# EAGLE design MHI-SPI_v1.0 (EAGLE 9.4.2)
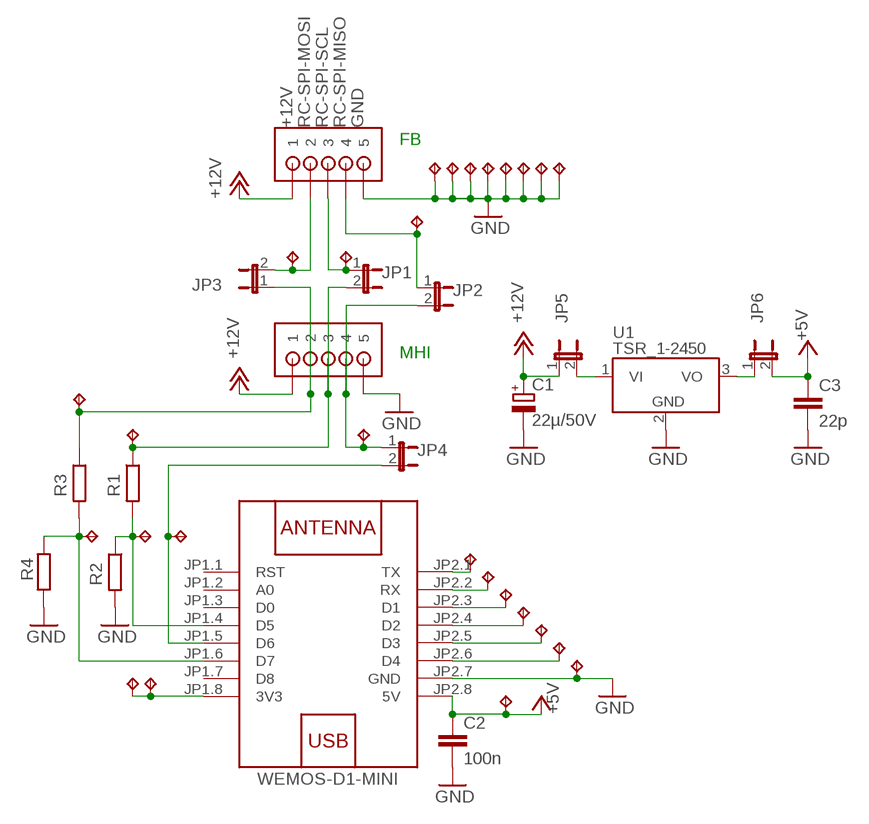
[diagram p0: schematic, sheet 1]

## Parts
C1  22µ/50V  CPOL-EUE5-10.5  [E5-10,5]
C2  100n  C-EU025-024X044  [C025-024X044]
C3  22p  C-EU025-024X044  [C025-024X044]
JP1  JP1E  [JP1]
JP2  JP1E  [JP1]
JP3  JP1E  [JP1]
JP4  JP1E  [JP1]
JP5  JP1E  [JP1]
JP6  JP1E  [JP1]
R1  R-EU_VMTA55  [VMTA55]
R2  R-EU_VMTA55  [VMTA55]
R3  R-EU_VMTA55  [VMTA55]
R4  R-EU_VMTA55  [VMTA55]
TP1  TPPAD1-13  [P1-13]
TP2  TPPAD1-13  [P1-13]
TP3  TPPAD1-13  [P1-13]
TP4  TPPAD1-13  [P1-13]
TP5  TPPAD1-13  [P1-13]
TP6  TPPAD1-13  [P1-13]
TP7  TPPAD1-13  [P1-13]
TP8  TPPAD1-13  [P1-13]
TP9  TPPAD1-13  [P1-13]
TP10  TPPAD1-13  [P1-13]
TP11  TPPAD1-13  [P1-13]
TP12  TPPAD1-13  [P1-13]
TP13  TPPAD1-13  [P1-13]
TP14  TPPAD1-13  [P1-13]
TP15  TPPAD1-13  [P1-13]
TP16  TPPAD1-13  [P1-13]
TP17  TPPAD1-13  [P1-13]
TP18  TPPAD1-13  [P1-13]
TP19  TPPAD1-13  [P1-13]
TP20  TPPAD1-13  [P1-13]
TP21  TPPAD1-13  [P1-13]
TP22  TPPAD1-13  [P1-13]
TP23  TPPAD1-13  [P1-13]
TP24  TPPAD1-13  [P1-13]
TP25  TPPAD1-13  [P1-13]
TP26  TPPAD1-13  [P1-13]
TP27  TPPAD1-13  [P1-13]
U1  TSR_1-2450  TSR_1-24_  [TSR-1]
U$1  WEMOS-D1-MINI  [WEMOS-D1-MINI]
U$4  JST-PH_5-PIN_HEADER  [JST_B5B-PH_HEADER]
U$5  JST-PH_5-PIN_HEADER  [JST_B5B-PH_HEADER]

## Nets
+3V3: TP22.TP TP23.TP U$1.JP1.8(3V3)
+5V: C2.1 C3.1 JP6.2 TP21.TP U$1.JP2.8(5V)
+12V: C1.+ JP5.1 U$4.P1 U$5.P1
D1: TP16.TP U$1.JP2.3(D1)
D2: TP17.TP U$1.JP2.4(D2)
D3: TP18.TP U$1.JP2.5(D3)
D4: TP19.TP U$1.JP2.6(D4)
GND: C1.- C2.2 C3.2 R2.2 R4.1 TP1.TP TP2.TP TP3.TP TP4.TP TP20.TP TP24.TP TP25.TP TP26.TP TP27.TP U1.2(GND) U$1.JP2.7(GND) U$4.P5 U$5.P5
MHI-SPI-MISO: JP2.2 JP4.1 TP8.TP U$5.P4
MHI-SPI-MOSI: JP3.1 R3.1 TP10.TP U$5.P2
MHI-SPI-SCL: JP1.2 R1.1 TP9.TP U$5.P3
MISO: JP4.2 TP11.TP U$1.JP1.5(D6)
MOSI: R3.2 R4.2 TP13.TP U$1.JP1.6(D7)
N$86: JP6.1 U1.3(VO)
RC-SPI-MISO: JP2.1 TP5.TP U$4.P4
RC-SPI-MOSI: JP3.2 TP7.TP U$4.P2
RC-SPI-SCL: JP1.1 TP6.TP U$4.P3
RX: TP15.TP U$1.JP2.2(RX)
SCK: R1.2 R2.1 TP12.TP U$1.JP1.4(D5)
TX: TP14.TP U$1.JP2.1(TX)
VI: JP5.2 U1.1(VI)
Unconnected: U$1.JP1.1(RST) U$1.JP1.2(A0) U$1.JP1.3(D0) U$1.JP1.7(D8)

## Notes on the sheet
- FB
- MHI

## Library data of the parts
C1 = rcl:CPOL-EU: POLARIZED CAPACITOR, European symbol; SPICEPREFIX: C
C2 C3 = rcl:C-EU: CAPACITOR, European symbol; SPICEPREFIX: C
JP1-JP6 = jumper:JP1E: JUMPER
R1-R4 = rcl:R-EU_: RESISTOR, European symbol; SPICEPREFIX: R
TP1-TP27 = testpad:TP: Test pad
U1 = _traco_tsr-1:TSR_1-*: TRACO TSR-1 Series Point-of-Load DC/DC-Converters Vi max. 36 V; Vo = (1.2 .. 15)V ±2%; Io = 0 .. 1 A SIP-Package (drop-in replacement for 78xx linear voltage regulators in TO220-package, vertically assembled) Source: www.tracopower.com Technologies: TSR 1- Vi (V) Vo (V) ±2% Io = 0 .. 1 A 24_ ( generic ) 2412 4.6 .. 36 1.2 2415 4.6 .. 36 1.5 2418 4.6 .. 36 1.8 2425 4.6 .. 36 2.5 2433 4.75.. 36 3.3 2450 6.5 .. 36 5.0 2465 9.0 .. 36 6.5 2490 12 .. 36 9.0 24120 15 .. 36 12 24150 18 .. 36 15 Author: Dipl.-Ing. FH Rainer Bayer HHN Hochschule Heilbronn, rainer.bayer@hs-heilbronn.de Ingenieurbüro ing-rb, mail@ing-rb.de
U$1 = diy-modules:WEMOS-D1-MINI: WEMOS D1 mini: Mini Wi-Fi Board based on ESP-8266 device More details can be found here: https://www.wemos.cc/product/d1-mini.html Click here to find device on ebay.com <http://www.ebay.com/sch/wemos+d1+mini+nodemcu>
U$4 U$5 = srg:JST-PH_5-PIN_HEADER: 5-pin JST PH Shrouded Header, top entry P/N B5B-PH-K-S Mating connector PHR-5 Mating cable assembly: Sparkfun PRT-09917 <http://www.sparkfun.com/products/9917>

## Board
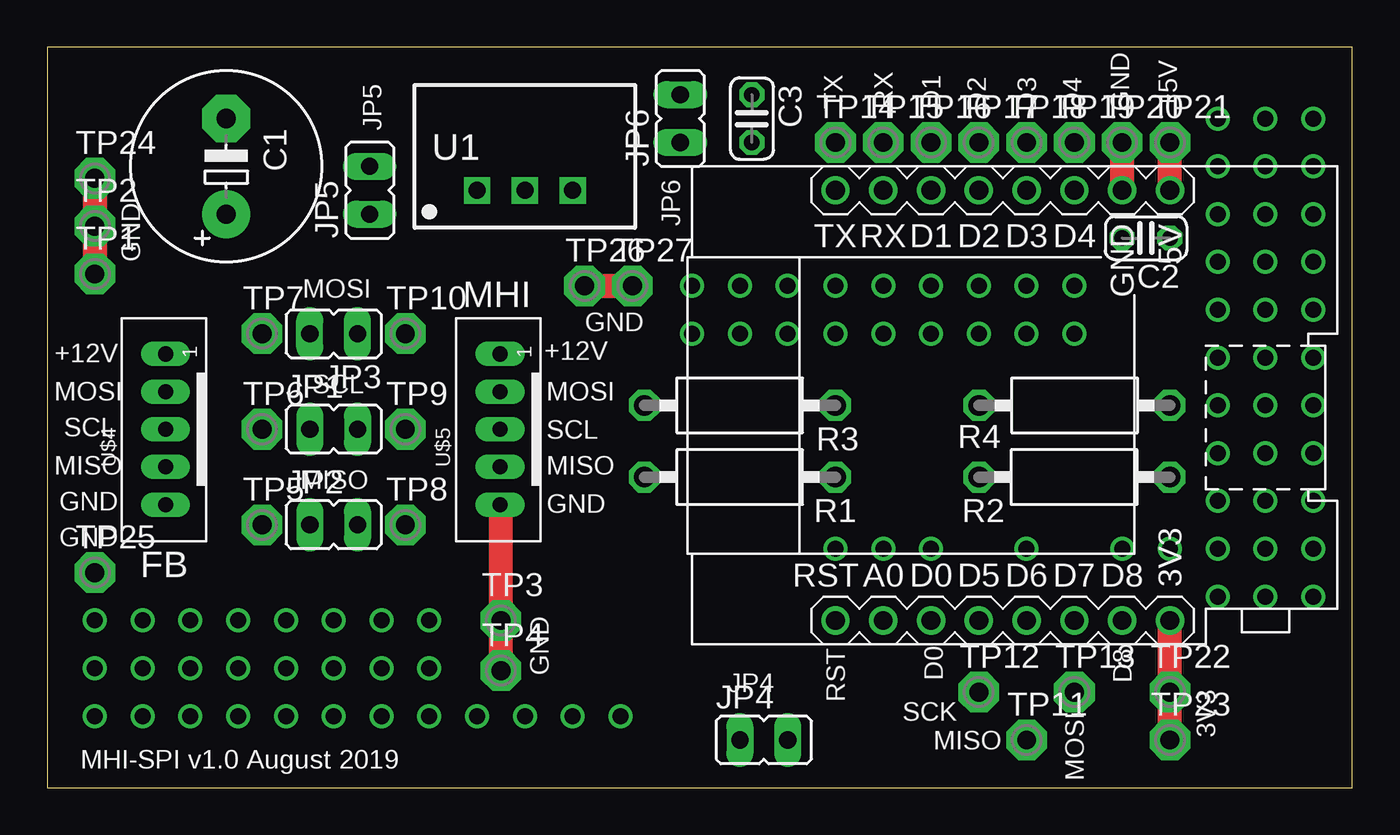
[diagram p1: board, top side]
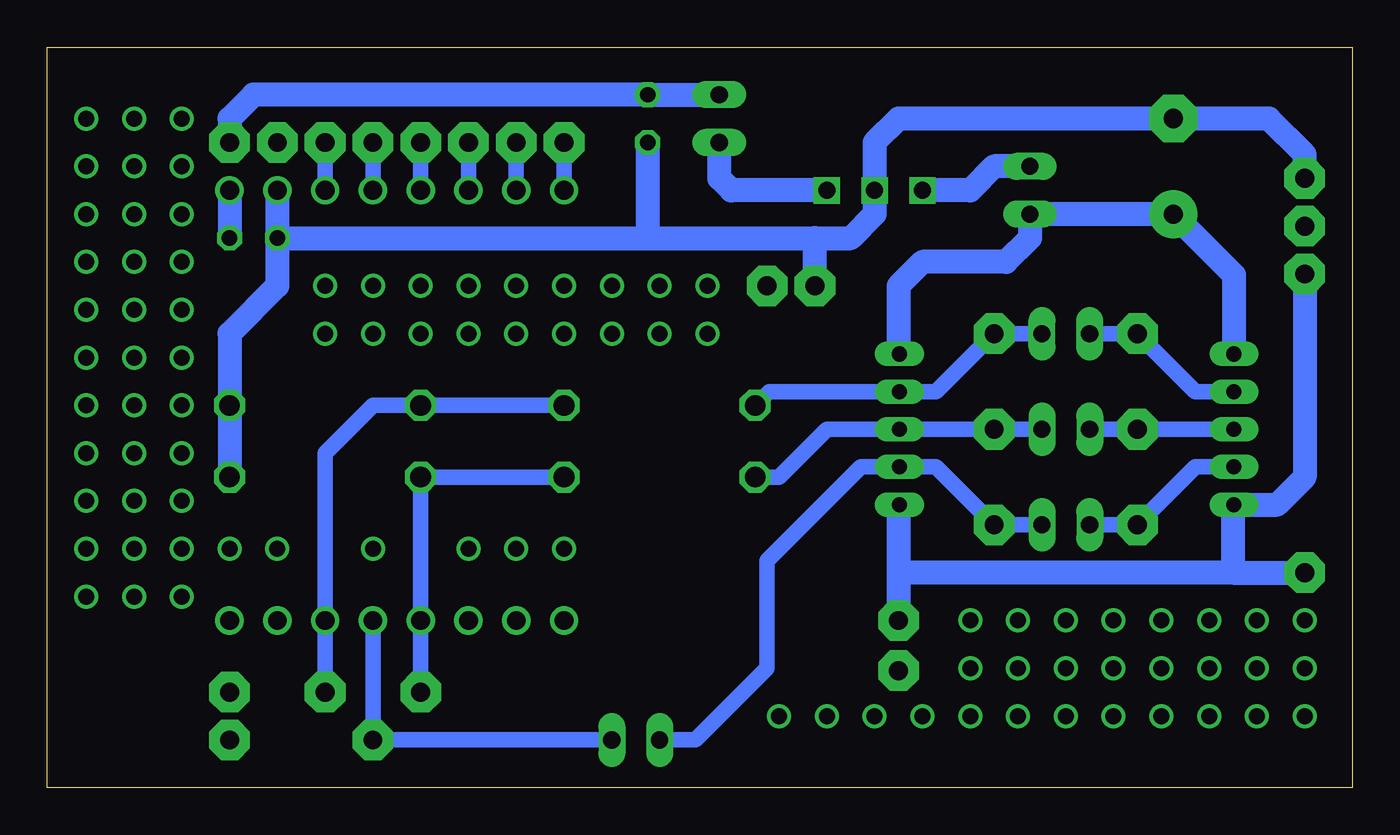
[diagram p2: board, bottom side, seen from below]

Size 69.39 x 39.36 mm. Coordinates in mm from the lower left corner, seen from the top.
Outline: 0,0 69.39,0 69.39,39.36 0,39.36 0,0
Copper layers (1*16): Top 0.035mm / dielectric 1.5mm / Bottom 0.035mm
Design rules "default": minimum track width 6mil, minimum drill 0.35mm, track to track 6mil, track to pad 6mil, pad to pad 6mil, via to via 6mil, smd to smd 6mil, copper to edge 40mil, drill to drill 6mil, minimum pad ring 10mil, minimum via ring 8mil, stop-mask expansion 4mil, vias tented up to drill 0mil, thermal gap 10mil

### Footprints (pad centres in the part's own frame; a part is rotated, then mirrored left to right if it is on the bottom)
E5-10,5 = drill 1.016 pad 2.54: + -2.54,0 | drill 1.016 pad 2.54 octagon: - 2.54,0
C025-024X044 = drill 0.813 octagon: 1 -1.27,0; 2 1.27,0
JP1 = drill 0.914 long: 1 0,-1.27; 2 0,1.27
VMTA55 = drill 1.1 octagon: 1 -5.08,0; 2 5.08,0
P1-13 = drill 1 pad 2.159 octagon: TP 0,0
TSR-1 = drill 0.9 square: 1 -2.54,0; 2 0,0; 3 2.54,0
WEMOS-D1-MINI = drill 1: JP1.1 -11.43,9.525; JP1.2 -11.43,6.985; JP1.3 -11.43,4.445; JP1.4 -11.43,1.905; JP1.5 -11.43,-0.635; JP1.6 -11.43,-3.175; JP1.7 -11.43,-5.715; JP1.8 -11.43,-8.255; JP2.1 11.43,9.525; JP2.2 11.43,6.985; JP2.3 11.43,4.445; JP2.4 11.43,1.905; JP2.5 11.43,-0.635; JP2.6 11.43,-3.175; JP2.7 11.43,-5.715; JP2.8 11.43,-8.255
JST_B5B-PH_HEADER = drill 0.8 long: P1 4,0.048; P2 2,0.048; P3 0,0.048; P4 -2,0.048; P5 -4,0.048

### Placement (x,y rotation side)
C1  9.53,33.02 90 top
C2  58.42,29.21 180 top
C3  37.47,35.56 270 top
JP1  15.24,19.05 270 top
JP2  15.24,13.97 270 top
JP3  15.24,24.13 90 top
JP4  38.1,2.54 270 top
JP5  17.14,31.75 0 top
JP6  33.66,35.56 0 top
R1  36.83,16.51 0 top
R2  54.61,16.51 0 top
R3  36.83,20.32 0 top
R4  54.61,20.32 180 top
TP1  2.54,27.3 0 top
TP2  2.54,29.84 0 top
TP3  24.13,8.89 0 top
TP4  24.13,6.22 0 top
TP5  11.43,13.97 0 top
TP6  11.43,19.05 0 top
TP7  11.43,24.13 0 top
TP8  19.05,13.97 0 top
TP9  19.05,19.05 0 top
TP10  19.05,24.13 0 top
TP11  52.07,2.54 0 top
TP12  49.53,5.08 0 top
TP13  54.61,5.08 0 top
TP14  41.91,34.29 0 top
TP15  44.45,34.29 0 top
TP16  46.99,34.29 0 top
TP17  49.53,34.29 0 top
TP18  52.07,34.29 0 top
TP19  54.61,34.29 0 top
TP20  57.15,34.29 0 top
TP21  59.69,34.29 0 top
TP22  59.69,5.08 0 top
TP23  59.69,2.54 0 top
TP24  2.54,32.38 0 top
TP25  2.54,11.43 0 top
TP26  28.57,26.67 0 top
TP27  31.11,26.67 0 top
U1  25.4,31.75 0 top
U$1  51.44,20.32 90 top
U$4  6.35,19.05 90 top
U$5  24.13,19.05 90 top

### Tracks (layer width: path | path; a pad name or v marks a point on that pad's centre or on a via)
+3V3
  Top 1.27: TP23.TP TP22.TP U$1.JP1.8
+5V
  Top 1.27: U$1.JP2.8 TP21.TP
  Bottom 1.27: U$1.JP2.8 C2.1 | JP6.2 C3.1 58.42,36.83 59.69,35.56 TP21.TP
+12V
  Bottom 1.27: U$4.P1 6.3,27.26 C1.+ JP5.1 17.14,29.21 18.41,27.94 22.86,27.94 24.13,26.67 24.13,23.1 U$5.P1
D1
  Bottom 0.813: TP16.TP U$1.JP2.3
D2
  Bottom 0.813: TP17.TP U$1.JP2.4
D3
  Bottom 0.813: TP18.TP U$1.JP2.5
D4
  Bottom 0.813: TP19.TP U$1.JP2.6
GND
  Top 1.27: TP4.TP TP3.TP 24.13,15 U$5.P5 | U$1.JP2.7 TP20.TP | TP26.TP TP27.TP | TP24.TP TP2.TP TP1.TP
  Bottom 1.27: R2.2 R4.1 59.69,24.13 57.15,26.67 C2.2 | C2.2 37.47,29.21 | 37.47,29.21 28.57,29.21 | 28.57,29.21 26.67,29.21 25.4,30.48 U1.2 25.4,34.29 24.13,35.56 C1.- 4.45,35.56 2.54,33.66 TP24.TP | U$1.JP2.7 C2.2 | C3.2 37.47,29.21 | 6.35,11.43 6.35,15 U$4.P5 4,15.05 2.54,16.51 TP1.TP | 6.35,11.43 24.13,11.43 | 24.13,11.43 TP3.TP | U$5.P5 24.13,15 24.13,11.43 | 6.35,11.43 TP25.TP | TP26.TP 28.57,29.21
MHI-SPI-MISO
  Bottom 0.813: JP4.1 34.92,2.54 31.11,6.35 31.11,12.06 26.13,17.05 U$5.P4 22.13,17.05 TP8.TP JP2.2
MHI-SPI-MOSI
  Bottom 0.813: R3.1 31.02,21.05 U$5.P2 22.13,21.05 TP10.TP JP3.1
MHI-SPI-SCL
  Bottom 0.813: R1.1 30.48,16.51 27.94,19.05 U$5.P3 TP9.TP JP1.2
MISO
  Bottom 0.813: U$1.JP1.5 TP11.TP JP4.2
MOSI
  Bottom 0.813: R3.2 R4.2 52.07,20.32 54.61,17.78 U$1.JP1.6 TP13.TP
N$1  (via drill 0.85)
  other vias: 2.54,6.35
N$2  (via drill 0.85)
  other vias: 2.54,8.89
N$3  (via drill 0.85)
  other vias: 5.08,8.89
N$4  (via drill 0.85)
  other vias: 7.62,8.89
N$5  (via drill 0.85)
  other vias: 10.16,8.89
N$6  (via drill 0.85)
  other vias: 12.7,8.89
N$7  (via drill 0.85)
  other vias: 15.24,8.89
N$8  (via drill 0.85)
  other vias: 17.78,8.89
N$9  (via drill 0.85)
  other vias: 17.78,6.35
N$10  (via drill 0.85)
  other vias: 15.24,6.35
N$11  (via drill 0.85)
  other vias: 12.7,6.35
N$12  (via drill 0.85)
  other vias: 10.16,6.35
N$13  (via drill 0.85)
  other vias: 7.62,6.35
N$14  (via drill 0.85)
  other vias: 5.08,6.35
N$15  (via drill 0.85)
  other vias: 67.31,17.78
N$16  (via drill 0.85)
  other vias: 67.31,20.32
N$17  (via drill 0.85)
  other vias: 64.77,22.86
N$18  (via drill 0.85)
  other vias: 64.77,35.56
N$19  (via drill 0.85)
  other vias: 20.32,3.81
N$20  (via drill 0.85)
  other vias: 22.86,3.81
N$21  (via drill 0.85)
  other vias: 25.4,3.81
N$22  (via drill 0.85)
  other vias: 17.78,3.81
N$23  (via drill 0.85)
  other vias: 15.24,3.81
N$24  (via drill 0.85)
  other vias: 12.7,3.81
N$25  (via drill 0.85)
  other vias: 10.16,3.81
N$26  (via drill 0.85)
  other vias: 7.62,3.81
N$27  (via drill 0.85)
  other vias: 5.08,3.81
N$28  (via drill 0.85)
  other vias: 2.54,3.81
N$29  (via drill 0.85)
  other vias: 27.94,3.81
N$30  (via drill 0.85)
  other vias: 20.32,8.89
N$31  (via drill 0.85)
  other vias: 20.32,6.35
N$32  (via drill 0.85)
  other vias: 30.48,3.81
N$33  (via drill 0.85)
  other vias: 41.91,26.67
N$34  (via drill 0.85)
  other vias: 44.45,26.67
N$35  (via drill 0.85)
  other vias: 46.99,26.67
N$36  (via drill 0.85)
  other vias: 49.53,26.67
N$37  (via drill 0.85)
  other vias: 52.07,26.67
N$38  (via drill 0.85)
  other vias: 54.61,26.67
N$39  (via drill 0.85)
  other vias: 54.61,24.13
N$40  (via drill 0.85)
  other vias: 52.07,24.13
N$41  (via drill 0.85)
  other vias: 49.53,24.13
N$42  (via drill 0.85)
  other vias: 46.99,24.13
N$43  (via drill 0.85)
  other vias: 44.45,24.13
N$44  (via drill 0.85)
  other vias: 41.91,24.13
N$45  (via drill 0.85)
  other vias: 39.37,24.13
N$46  (via drill 0.85)
  other vias: 36.83,24.13
N$47  (via drill 0.85)
  other vias: 34.29,24.13
N$48  (via drill 0.85)
  other vias: 34.29,26.67
N$49  (via drill 0.85)
  other vias: 36.83,26.67
N$50  (via drill 0.85)
  other vias: 39.37,26.67
N$51  (via drill 0.85)
  other vias: 67.31,10.16
N$52  (via drill 0.85)
  other vias: 64.77,15.24
N$53  (via drill 0.85)
  other vias: 67.31,15.24
N$54  (via drill 0.85)
  other vias: 62.23,15.24
N$55  (via drill 0.85)
  other vias: 64.77,12.7
N$56  (via drill 0.85)
  other vias: 67.31,12.7
N$57  (via drill 0.85)
  other vias: 62.23,10.16
N$58  (via drill 0.85)
  other vias: 64.77,10.16
N$59  (via drill 0.85)
  other vias: 62.23,12.7
N$60  (via drill 0.85)
  other vias: 59.69,12.7
N$61  (via drill 0.85)
  other vias: 57.15,12.7
N$62  (via drill 0.85)
  other vias: 52.07,12.7
N$63  (via drill 0.85)
  other vias: 46.99,12.7
N$64  (via drill 0.85)
  other vias: 44.45,12.7
N$65  (via drill 0.85)
  other vias: 41.91,12.7
N$66  (via drill 0.85)
  other vias: 62.23,17.78
N$67  (via drill 0.85)
  other vias: 62.23,20.32
N$68  (via drill 0.85)
  other vias: 64.77,17.78
N$69  (via drill 0.85)
  other vias: 64.77,20.32
N$70  (via drill 0.85)
  other vias: 67.31,22.86
N$71  (via drill 0.85)
  other vias: 62.23,22.86
N$72  (via drill 0.85)
  other vias: 62.23,25.4
N$73  (via drill 0.85)
  other vias: 64.77,25.4
N$74  (via drill 0.85)
  other vias: 67.31,25.4
N$75  (via drill 0.85)
  other vias: 62.23,27.94
N$76  (via drill 0.85)
  other vias: 64.77,27.94
N$77  (via drill 0.85)
  other vias: 67.31,27.94
N$78  (via drill 0.85)
  other vias: 64.77,30.48
N$79  (via drill 0.85)
  other vias: 62.23,30.48
N$80  (via drill 0.85)
  other vias: 67.31,30.48
N$81  (via drill 0.85)
  other vias: 67.31,33.02
N$82  (via drill 0.85)
  other vias: 67.31,35.56
N$83  (via drill 0.85)
  other vias: 62.23,35.56
N$84  (via drill 0.85)
  other vias: 62.23,33.02
N$85  (via drill 0.85)
  other vias: 64.77,33.02
N$86
  Bottom 1.27: JP6.1 33.66,32.38 33.02,31.75 U1.3
RC-SPI-MISO
  Bottom 0.813: U$4.P4 8.35,17.05 TP5.TP JP2.1
RC-SPI-MOSI
  Bottom 0.813: U$4.P2 8.35,21.05 TP7.TP JP3.2
RC-SPI-SCL
  Bottom 0.813: U$4.P3 TP6.TP JP1.1
RX
  Bottom 0.813: TP15.TP U$1.JP2.2
SCK
  Bottom 0.813: R1.2 R2.1 U$1.JP1.4 TP12.TP
TX
  Bottom 0.813: TP14.TP U$1.JP2.1
VI
  Bottom 1.27: JP5.2 19.05,33.02 20.32,31.75 U1.1

### Text on the board
tPlace: TX | RX | D1 | D2 | D3 | D4 | GND | +5V | JP5 | JP6 | GND | MOSI | MHI | GND | +12V | +12V | MOSI | SCL | MOSI | SCL | SCL | MISO | MISO | MISO | GND | GND | GND | FB | GND | D0 | D8 | JP4 | RST | SCK | 3V3 | MISO | MHI-SPI v1.0 August 2019 | MOSI